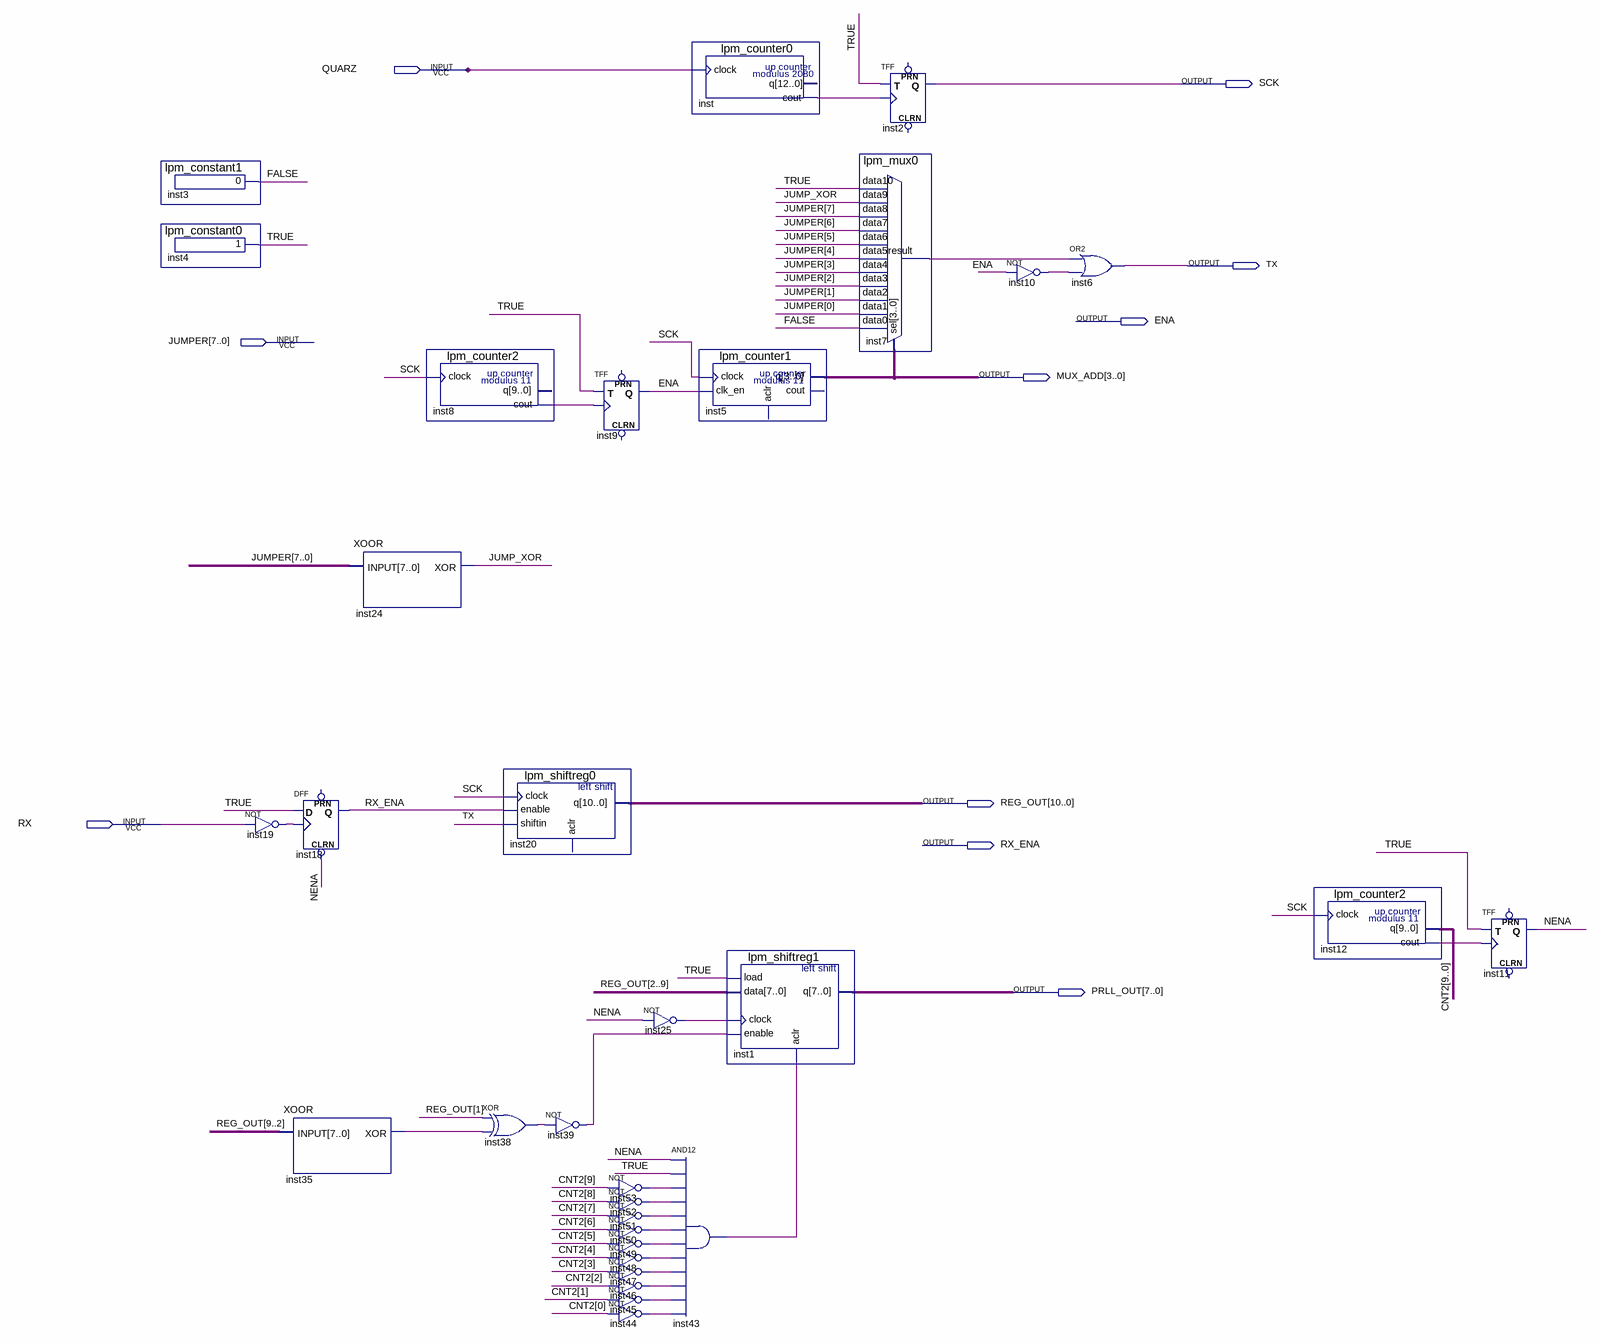
[diagram p0: schematic sheet]
// Quartus schematic UART.bdf as structural Verilog: 32 symbols, 10 pins
module UART (
  input  QUARZ,
  input  [7:0] JUMPER,
  input  RX,
  output SCK,
  output TX,
  output ENA,
  output [3:0] MUX_ADD,
  output [10:0] REG_OUT,
  output RX_ENA,
  output [7:0] PRLL_OUT
);

  wire FALSE, inst7_result, inst8_cout, inst10_out, inst12_cout, inst19_out, inst25_out, inst35_xor,
       inst38_out, inst39_out, inst43_out, inst44_out, inst45_out, inst46_out, inst47_out, inst48_out,
       inst49_out, inst50_out, inst51_out, inst52_out, inst53_out, inst_cout, JUMP_XOR, NENA, TRUE;
  wire [9:0] CNT2;

  lpm_constant1 inst3 (.result(FALSE));
  lpm_constant0 inst4 (.result(TRUE));
  not inst19 (inst19_out, RX);
  DFF inst18 (.CLRN(NENA), .CLK(inst19_out), .D(TRUE), .Q(RX_ENA));  // open: PRN
  XOOR inst35 (.INPUT(REG_OUT[9:2]), .XOR(inst35_xor));
  XOOR inst24 (.INPUT(JUMPER), .XOR(JUMP_XOR));
  lpm_counter2 inst8 (.clock(SCK), .cout(inst8_cout));  // open: q
  xor inst38 (inst38_out, REG_OUT[1], inst35_xor);
  lpm_shiftreg0 inst20 (.clock(SCK), .enable(RX_ENA), .shiftin(TX), .q(REG_OUT));  // open: aclr
  not inst39 (inst39_out, inst38_out);
  TFF inst9 (.T(TRUE), .CLK(inst8_cout), .Q(ENA));  // open: PRN, CLRN
  not inst53 (inst53_out, CNT2[9]);
  not inst52 (inst52_out, CNT2[8]);
  not inst51 (inst51_out, CNT2[7]);
  not inst50 (inst50_out, CNT2[6]);
  not inst49 (inst49_out, CNT2[5]);
  not inst48 (inst48_out, CNT2[4]);
  not inst47 (inst47_out, CNT2[3]);
  not inst46 (inst46_out, CNT2[2]);
  not inst45 (inst45_out, CNT2[1]);
  not inst44 (inst44_out, CNT2[0]);
  not inst25 (inst25_out, NENA);
  lpm_counter0 inst (.clock(QUARZ), .cout(inst_cout));  // open: q
  lpm_counter1 inst5 (.clock(SCK), .clk_en(ENA), .q(MUX_ADD));  // open: aclr, cout
  and inst43 (inst43_out, NENA, TRUE, inst53_out, inst52_out, inst51_out, inst50_out, inst49_out, inst48_out, inst47_out, inst46_out, inst45_out, inst44_out);
  lpm_shiftreg1 inst1 (
    .load(TRUE),
    .data({REG_OUT[2], REG_OUT[3], REG_OUT[4], REG_OUT[5], REG_OUT[6], REG_OUT[7], REG_OUT[8], REG_OUT[9]}),
    .clock(inst25_out), .enable(inst39_out), .aclr(inst43_out), .q(PRLL_OUT));
  TFF inst2 (.T(TRUE), .CLK(inst_cout), .Q(SCK));  // open: PRN, CLRN
  lpm_mux0 inst7 (
    .data10(TRUE), .data9(JUMP_XOR), .data8(JUMPER[7]), .data7(JUMPER[6]), .data6(JUMPER[5]),
    .data5(JUMPER[4]), .data4(JUMPER[3]), .data3(JUMPER[2]), .data2(JUMPER[1]), .data1(JUMPER[0]),
    .data0(FALSE), .sel(MUX_ADD), .result(inst7_result));
  not inst10 (inst10_out, ENA);
  or inst6 (TX, inst7_result, inst10_out);
  lpm_counter2 inst12 (.clock(SCK), .cout(inst12_cout), .q(CNT2));
  TFF inst11 (.T(TRUE), .CLK(inst12_cout), .Q(NENA));  // open: PRN, CLRN
endmodule
